# Altium project ECU.PrjPcb (part 1 of 2)
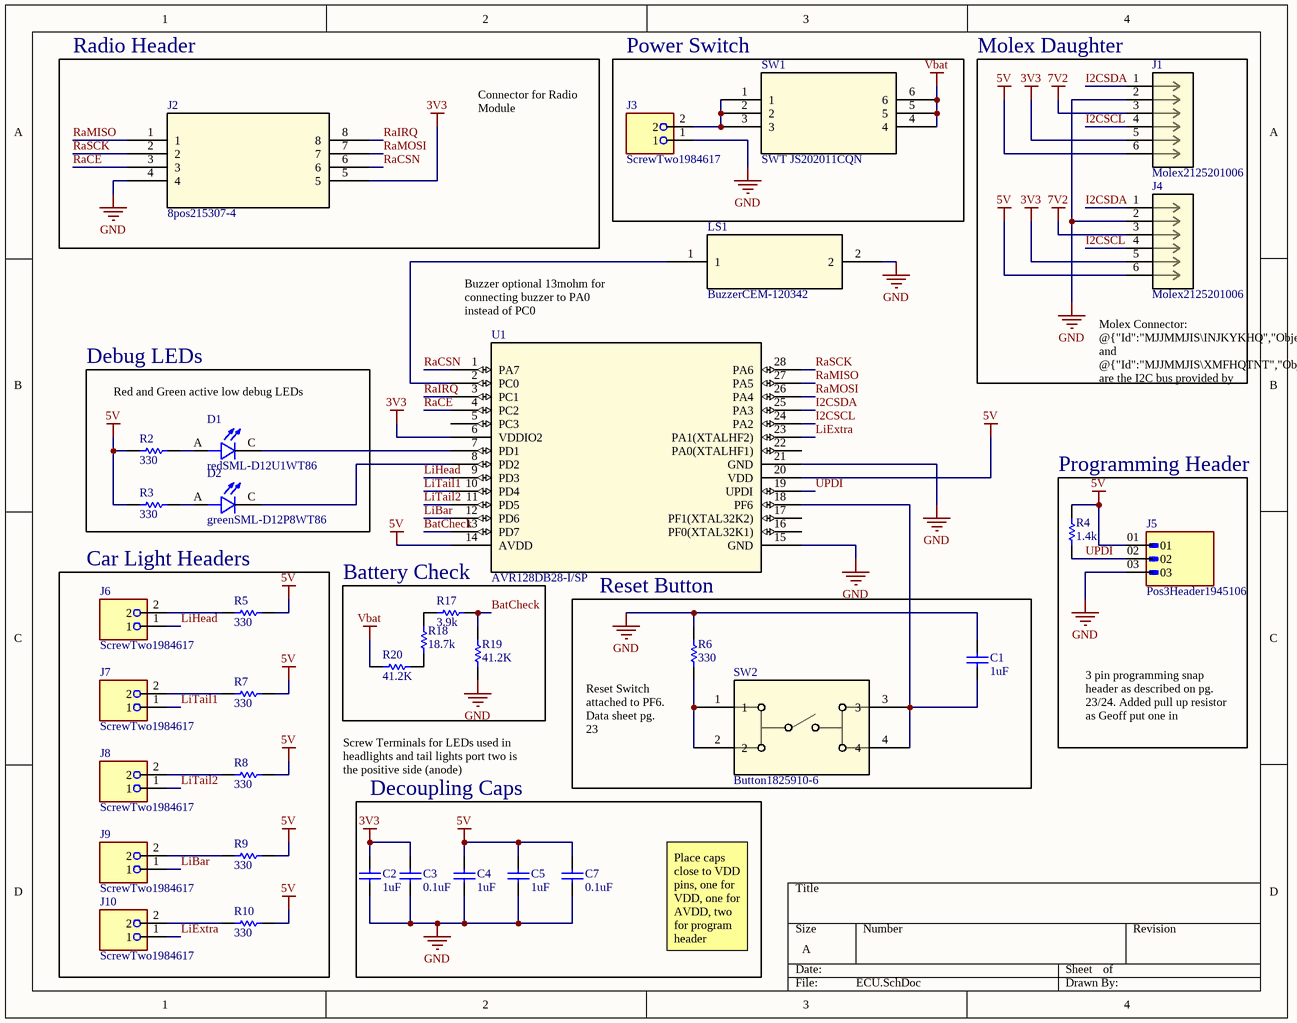
[diagram p0: ECU.SchDoc]
2 sheets, 63 parts. Net scope: global (net labels, ports and power ports of the same name join across sheets).
Board file: ecupcb.PcbDoc
Sheets:
  ECU.SchDoc
  PowerSupply.SchDoc

## Sheet ECU.SchDoc
size A; SheetNumber: 1; SheetTotal: 2

### Parts
C1  1uF  [RES 0805]
C2  1uF  [RES 0805]
C3  0.1uF  [RES 0805]
C4  1uF  [RES 0805]
C5  1uF  [RES 0805]
C7  0.1uF  [RES 0805]
D1  redSML-D12U1WT86  [0603LED]
D2  greenSML-D12P8WT86  [0603LED]
J1  Molex2125201006  [Molex2125201006]
J2  8pos215307-4  [215307-4]
J3  ScrewTwo1984617  [PHOENIX_1984617]
J4  Molex2125201006  [Molex2125201006]
J5  Pos3Header1945106  [Pos3Header]
J6  ScrewTwo1984617  [PHOENIX_1984617]
J7  ScrewTwo1984617  [PHOENIX_1984617]
J8  ScrewTwo1984617  [PHOENIX_1984617]
J9  ScrewTwo1984617  [PHOENIX_1984617]
J10  ScrewTwo1984617  [PHOENIX_1984617]
LS1  BuzzerCEM-120342  [CEM-1203(42)]
R2  330  [RES 0805]
R3  330  [RES 0805]
R4  1.4k  [RES 0805]
R5  330  [RES 0805]
R6  330  [RES 0805]
R7  330  [RES 0805]
R8  330  [RES 0805]
R9  330  [RES 0805]
R10  330  [RES 0805]
R17  3.9k  [RES 0805]
R18  18.7k  [RES 0805]
R19  41.2K  [RES 0805]
R20  41.2K  [RES 0805]
SW1  SWT JS202011CQN  [SWTJS202011CQN]
SW2  Button1825910-6  [Button1825910-6]
U1  AVR128DB28-I/SP  [AVR128DB28-ISP]

### Blocks framed on the sheet
Radio Header: J2
Power Switch: J3 SW1
Molex Daughter: J1 J4
Debug LEDs: D1 D2 R2 R3
Programming Header: J5 R4
Car Light Headers: J6-J10 R5 R7-R10
Battery Check: R17-R20
Reset Button: C1 R6 SW2
Decoupling Caps: C2-C5 C7

### Nets
3V3: C2.2 C3.2 J1.5 J2.5 J4.5 U1.6(VDDIO2)
5V: C4.2 C5.1 C7.2 J1.6 J4.6 J5.01 R2.1 R3.1 R4.2 R5.2 R7.2 R8.2 R9.2 R10.2 U1.14(AVDD) U1.20(VDD)
7V2: J1.3 J4.3
GND: C1.2 C2.1 C3.1 C4.1 C5.2 C7.1 J1.2 J2.4 J3.1 J4.2 J5.03 LS1.2 R6.2 R19.1 U1.15(GND) U1.21(GND)
Vbat: R20.2 SW1.4 SW1.5 SW1.6
BatCheck: R17.2 R19.2 U1.13(PD7)
I2CSCL: J1.4 J4.4 U1.24(PA2)
I2CSDA: J1.1 J4.1 U1.25(PA3)
LiBar: J9.1 U1.12(PD6)
LiExtra: J10.1 U1.23(PA1(XTALHF2))
LiHead: J6.1 U1.9(PD3)
LiTail1: J7.1 U1.10(PD4)
LiTail2: J8.1 U1.11(PD5)
RaCE: J2.3 U1.4(PC2)
RaCSN: J2.6 U1.1(PA7)
RaIRQ: J2.8 U1.3(PC1)
RaMISO: J2.1 U1.27(PA5)
RaMOSI: J2.7 U1.26(PA4)
RaSCK: J2.2 U1.28(PA6)
UPDI: J5.02 R4.1 U1.19(UPDI)
NetC1_1: C1.1 SW2.3 SW2.4 U1.18(PF6)
NetD1_A: D1.A R2.2
NetD1_C: D1.C U1.7(PD1)
NetD2_A: D2.A R3.2
NetD2_C: D2.C U1.8(PD2)
NetJ3_2: J3.2 SW1.1 SW1.2 SW1.3
NetJ6_2: J6.2 R5.1
NetJ7_2: J7.2 R7.1
NetJ8_2: J8.2 R8.1
NetJ9_2: J9.2 R9.1
NetJ10_2: J10.2 R10.1
NetLS1_1: LS1.1 U1.2(PC0)
NetR6_1: R6.1 SW2.1 SW2.2
NetR17_1: R17.1 R18.1
NetR18_2: R18.2 R20.1

Not connected (* = marked no-connect by the designer): U1 5(PC3) 16(PF0(XTAL32K1)) 17(PF1(XTAL32K2)) 22(PA0(XTALHF1))

### Notes on the sheet
- Connector for Radio Module
- (near U1) Buzzer optional 13mohm for connecting buzzer to PA0 instead of PC0
- Red and Green active low debug LEDs
- (near J4) Molex Connector: @{"Id":"MJJMMJIS\INJKYKHQ","ObjectType":1} and @{"Id":"MJJMMJIS\XMFHQTNT","ObjectType":1} are the I2C bus provided by the molex connector to slave boards
- Screw Terminals for LEDs used in headlights and tail lights port two is the positive side (anode)
- (near R6) Reset Switch attached to PF6. Data sheet pg. 23
- 3 pin programming snap header as described on pg. 23/24. Added pull up resistor as Geoff put one in
- Place caps close to VDD pins, one for VDD, one for AVDD, two for program header

### Library data of the parts
C1 C2 C4 C5 = CAP CER 1uF 10% 50V 0805: Ceramic Capacitor, Multilayer, Ceramic, 50V, 10% +Tol, 10% -Tol, X7R, 15% TC, 1uF, Surface Mount, 0805; Manufacturer: Samsung; Manufacturer Part Number: CL21B105KBFNNNE; Multilayer: Yes; Supplier: Digikey; Supplier Part Number: 1276-1029-1-ND; RoHS: Yes; Category: Ceramic Capacitors; Stock: 572828; Pricing: 1=0.1, 10=0.051, 100=0.0321, 1000=0.02181 (USD); Mounting Technology: Surface Mount; Pins: 2; Dielectric Material: Ceramic; Package Shape: Rectangular; Case/Package: 0805; Terminal Finish: Nickel; Min Operating Temperature: -55°C; Max Operating Temperature: 125°C; JESD-609 Code: e3; Value: 1uF; Capacitor Type: Ceramic; Tolerance  (fill in as +-): 10%; Package Style: SMTMeter; Packaging: Tape and Reel; Tolerance (fill in as +-): 10%; Rated DC Voltage (URdc): 50V; Temperature Characteristics Code: X7R; Termination: Wraparound; Length: 2mm; Width: 1.25mm; Height: 1.35mm; Reach SVHC Compliant: Yes; RoHS Compliant: Yes; ComponentLink1URL: https://datasheet.ciiva.com:443/pdfs/VipMasterIC/IC/SEMS/SEMS-S-A0008524728/SEMS-S-A0008523023-1.pdf?src-supplier=IHS+Markit; ComponentLink1Description: https://datasheet.ciiva.com:443/pdfs/VipMasterIC/IC/SEMS/SEMS-S-A0008524728/SEMS-S-A0008523023-1.pdf?src-supplier=IHS+Markit; ComponentLink2URL: https://datasheet.ciiva.com/25800/cl21b105kbfnnne-25800291.pdf?src-supplier=Digikey; ComponentLink2Description: https://datasheet.ciiva.com/25800/cl21b105kbfnnne-25800291.pdf?src-supplier=Digikey; ComponentLink3URL: https://datasheet.ciiva.com/16449/cl21b105kbfnnne-16449003.pdf?src-supplier=Future+Electronics; ComponentLink3Description: https://datasheet.ciiva.com/16449/cl21b105kbfnnne-16449003.pdf?src-supplier=Future+Electronics
C3 C7 = CAP CER 0.1uF 10% 50V 0805: Ceramic Capacitor, Multilayer, Ceramic, 50V, 10% +Tol, 10% -Tol, X7R, 15% TC, 0.1uF, Surface Mount, 0805; Manufacturer: Yageo; Manufacturer Part Number: CC0805KRX7R9BB104; Value: 100nF; Multilayer: Yes; Supplier: Digikey; Supplier Part Number: 311-1140-1-ND; RoHS: Yes; Category: Ceramic Capacitors; Stock: 3691132; Pricing: 1=0.08, 10=0.021, 100=0.0152, 1000=0.0144, 4000=0.0112, 8000=0.0104, 12000=0.01, 20000=0.00985 (USD); Mounting Technology: Surface Mount; Pins: 2; Dielectric Material: Ceramic; Package Shape: Rectangular; Case/Package: 0805; Terminal Finish: Nickel; Min Operating Temperature: -55°C; Max Operating Temperature: 125°C; JESD-609 Code: e3; Capacitor Type: Ceramic; Tolerance  (fill in as +-): 10%; Package Style: SMTMeter; Packaging: Tape and Reel; Tolerance (fill in as +-): 10%; Rated DC Voltage (URdc): 50V; Temperature Characteristics Code: X7R; Termination: Wraparound; Length: 2mm; Width: 1.25mm; Height: 0.85mm; Reach SVHC Compliant: Yes; RoHS Compliant: Yes; ComponentLink1URL: https://datasheet.ciiva.com:443/pdfs/VipMasterIC/IC/YAGO/YAGO-S-A0003557223/YAGO-S-A0003557223-1.pdf?src-supplier=IHS+Markit; ComponentLink1Description: https://datasheet.ciiva.com:443/pdfs/VipMasterIC/IC/YAGO/YAGO-S-A0003557223/YAGO-S-A0003557223-1.pdf?src-supplier=IHS+Markit; ComponentLink2URL: https://datasheet.ciiva.com/11786/0900766b80d84f1d-11786009.pdf?src-supplier=Rs; ComponentLink2Description: https://datasheet.ciiva.com/11786/0900766b80d84f1d-11786009.pdf?src-supplier=Rs; ComponentLink3URL: https://datasheet.ciiva.com/155/mlccorderingcode-155929.pdf?src-supplier=Digikey; ComponentLink3Description: https://datasheet.ciiva.com/155/mlccorderingcode-155929.pdf?src-supplier=Digikey; ComponentLink4URL: https://datasheet.ciiva.com/155/mlccorderingcode-155930.pdf?src-supplier=Digikey; ComponentLink4Description: https://datasheet.ciiva.com/155/mlccorderingcode-155930.pdf?src-supplier=Digikey; ComponentLink5URL: https://datasheet.ciiva.com/155/mlccorderingcode-155931.pdf?src-supplier=Digikey; ComponentLink5Description: https://datasheet.ciiva.com/155/mlccorderingcode-155931.pdf?src-supplier=Digikey; ComponentLink6URL: https://datasheet.ciiva.com/46393/1734573-46393307.pdf?src-supplier=Element14; ComponentLink6Description: https://datasheet.ciiva.com/46393/1734573-46393307.pdf?src-supplier=Element14; ComponentLink7URL: https://datasheet.ciiva.com/28450/1489800-28450805.pdf?src-supplier=Element14; ComponentLink7Description: https://datasheet.ciiva.com/28450/1489800-28450805.pdf?src-supplier=Element14; ComponentLink8URL: https://datasheet.ciiva.com/11464/upy-gphc-x7r-6-3v-to-50v-8-11464757.pdf?src-supplier=Avnet; ComponentLink8Description: https://datasheet.ciiva.com/11464/upy-gphc-x7r-6-3v-to-50v-8-11464757.pdf?src-supplier=Avnet; ComponentLink9URL: https://datasheet.ciiva.com/29242/445210-da-01-en-kerko-chip-0805-x7r-0-1uf-10proz-50vg-29242074.pdf?src-supplier=Conrad; ComponentLink9Description: https://datasheet.ciiva.com/29242/445210-da-01-en-kerko-chip-0805-x7r-0-1uf-10proz-50vg-29242074.pdf?src-supplier=Conrad
D1 = redSML-D12U1WT86: Single Color LED, Red, Milky White, 1.2mm; Manufacturer: Rohm; Shape: Rectangular; Forward Current: 20mA; Luminous Intensity-Nom: 63mcd; Channels: 1; Overall Height: 0.55mm; Supplier: Digikey; Supplier Part Number: SML-D12U1WT86CT-ND; Manufacturer Part Number: SML-D12U1WT86; RoHS: Yes; Category: LEDs; Stock: 145541; Pricing: 1=0.12, 10=0.081, 100=0.0556, 500=0.0438, 1000=0.03986 (USD); Mounting Technology: Surface Mount; Pins: 2; Color: Red; Min Operating Temperature: -40°C; Max Operating Temperature: 85°C; Lens Style: MILKY WHITE; Optoelectronic Device Type: SINGLE COLOR LED; Packaging: Tape and Reel; Size: 1.2mm; Terminal Pitch: 1.65mm; Reach SVHC Compliant: Yes; RoHS Compliant: Yes; ComponentLink1URL: https://datasheet.ciiva.com:443/pdfs/VipMasterIC/IC/ROHM/ROHM-S-A0002134492/ROHM-S-A0002134492-1.pdf?src-supplier=IHS+Markit; ComponentLink1Description: https://datasheet.ciiva.com:443/pdfs/VipMasterIC/IC/ROHM/ROHM-S-A0002134492/ROHM-S-A0002134492-1.pdf?src-supplier=IHS+Markit; ComponentLink2URL: https://www.rohm.com/datasheet/SML-D12U1W?src-supplier=Digikey; ComponentLink2Description: https://www.rohm.com/datasheet/SML-D12U1W?src-supplier=Digikey; ComponentLink3URL: https://datasheet.octopart.com/SML-D12U1WT86-Rohm-datasheet-68298509.pdf?src-supplier=Future+Electronics; ComponentLink3Description: https://datasheet.octopart.com/SML-D12U1WT86-Rohm-datasheet-68298509.pdf?src-supplier=Future+Electronics; ComponentLink4URL: https://datasheet.octopart.com/SML-D12U1WT86-ROHM-datasheet-142144710.pdf?src-supplier=TME; ComponentLink4Description: https://datasheet.octopart.com/SML-D12U1WT86-ROHM-datasheet-142144710.pdf?src-supplier=TME
D2 = greenSML-D12P8WT86: Single Color LED, Pure Green, Diffused Milky White, 1.2mm; Manufacturer: Rohm; Shape: Rectangular; Forward Current: 20mA; Luminous Intensity-Nom: 6.3mcd; Channels: 1; Reverse Voltage-Max: 5V; Overall Height: 0.55mm; Supplier: Digikey; Supplier Part Number: 846-SML-D12P8WT86CT-ND; Manufacturer Part Number: SML-D12P8WT86; RoHS: Yes; Category: LEDs; Stock: 24850; Pricing: 1=0.14, 10=0.094, 100=0.0648, 500=0.05124, 1000=0.04672 (USD); Mounting Technology: Surface Mount; Pins: 2; Color: Green; Color@wavelength: Green; Terminal Finish: Gold; Min Operating Temperature: -40°C; Max Operating Temperature: 85°C; JESD-609 Code: e4; Lens Style: Diffused; Optoelectronic Device Type: SINGLE COLOR LED; Packaging: Tape and Reel; Size: 1.2mm; Terminal Pitch: 1.65mm; Reach SVHC Compliant: Yes; RoHS Compliant: Yes; ComponentLink1URL: https://datasheet.ciiva.com:443/pdfs/VipMasterIC/IC/ROHM/ROHMS10041/ROHMS10041-1.pdf?src-supplier=IHS+Markit; ComponentLink1Description: https://datasheet.ciiva.com:443/pdfs/VipMasterIC/IC/ROHM/ROHMS10041/ROHMS10041-1.pdf?src-supplier=IHS+Markit; ComponentLink2URL: https://datasheet.ciiva.com/2110/sml-d1-2110417.pdf?src-supplier=Digikey; ComponentLink2Description: https://datasheet.ciiva.com/2110/sml-d1-2110417.pdf?src-supplier=Digikey; ComponentLink3URL: https://datasheet.ciiva.com/16488/rohm20sml-d12p8wt86-16488100.pdf?src-supplier=Future+Electronics; ComponentLink3Description: https://datasheet.ciiva.com/16488/rohm20sml-d12p8wt86-16488100.pdf?src-supplier=Future+Electronics; ComponentLink4URL: https://datasheet.ciiva.com/2110/sml-d1-2110418.pdf?src-supplier=Digikey; ComponentLink4Description: https://datasheet.ciiva.com/2110/sml-d1-2110418.pdf?src-supplier=Digikey; ComponentLink5URL: https://datasheet.ciiva.com/2110/sml-d1-2110419.pdf?src-supplier=Digikey; ComponentLink5Description: https://datasheet.ciiva.com/2110/sml-d1-2110419.pdf?src-supplier=Digikey; ComponentLink6URL: https://datasheet.ciiva.com/3161/sml-d1-3161420.pdf?src-supplier=Avnet; ComponentLink6Description: https://datasheet.ciiva.com/3161/sml-d1-3161420.pdf?src-supplier=Avnet
J1 J4 = Molex2125201006: Connector Power Header 6 Position 4.2mm Solder Through Hole Tray; Manufacturer: Molex; Manufacturer Part Number: 212520-1006; Supplier: Arrow Electronics; Supplier Part Number: 212520-1006; RoHS: No; Category: Connectors; Stock: 2143; Pricing: 1=1.083 (USD)
J2 = 8pos215307-4: Board Connector, 4 Contact(s), 2 Row(s), Female, Straight, 0.1 inch Pitch, Solder Terminal, Black Insulator, Receptacle; Manufacturer: TE Connectivity; Option: General Purpose; Contact Pattern: RECTANGULAR; Contact Style: BELLOWED TYPE; Dielectric Withstanding Voltage (AC): 750V; Filter Feature: No; Insulation Resistance: 5GR; Number Of Connectors: 1; Number Of PCB Rows: 2; Number of Contacts: 8; Body Breadth: 0.199inch; Body Depth: 0.276inch; PCB Contact Row Spacing: 2.54mm; Plating Thickness: 31uin; Reference Standard: UL; Reliability: COMMERCIAL; Supplier: Avnet; Supplier Part Number: 98K6517; Manufacturer Part Number: 215307-4; RoHS: Yes; Category: Headers and Wire Housings; Stock: 250; Pricing: 1=0.863, 10=0.776, 25=0.761, 50=0.746, 100=0.731 (USD); Mounting Technology: Board; Contact Material: Bronze; Contact Finish - Mating: NOT SPECIFIED; Contact Finish - Termination: Tin (Sn); Insulation Color: Green; Insulation Material: Glass; Min Operating Temperature: -65°C; Max Operating Temperature: 125°C; JESD-609 Code: e3; Connector Type: BOARD CONNECTOR; Body/Shell Style: RECEPTACLE; Contact Gender: Female; Mixed Contacts: No; Mounting Style: STRAIGHT; Number of Rows Loaded: 2; PCB Contact Pattern: RECTANGULAR; Termination: Solder; Mating Contact Pitch: 0.1inch; Mating Contact Row Spacing: 0.1inch; Terminal Length: 0.118inch; Terminal Pitch: 2.54mm; Flammability Rating: UL94 V-0; Reach SVHC Compliant: Yes; RoHS Compliant: Yes; DIN Conformance: No; IEC Conformance: No; MIL Conformance: No; ComponentLink1URL: https://www.te.com:443/usa-en/product-215307-4.html?src-supplier=IHS+Markit; ComponentLink1Description: https://www.te.com:443/usa-en/product-215307-4.html?src-supplier=IHS+Markit; ComponentLink2URL: https://datasheet.ciiva.com/30070/2153074-30070134.pdf?src-supplier=Onlinecomponents.com; ComponentLink2Description: https://datasheet.ciiva.com/30070/2153074-30070134.pdf?src-supplier=Onlinecomponents.com; ComponentLink3URL: https://datasheet.ciiva.com/11748/0900766b804f4b20-11748752.pdf?src-supplier=Rs; ComponentLink3Description: https://datasheet.ciiva.com/11748/0900766b804f4b20-11748752.pdf?src-supplier=Rs; ComponentLink4URL: https://datasheet.ciiva.com/29369/001094904-da-01-en-buchsenleiste-2-reihig-0-0215307-4-29369976.pdf?src-supplier=Conrad; ComponentLink4Description: https://datasheet.ciiva.com/29369/001094904-da-01-en-buchsenleiste-2-reihig-0-0215307-4-29369976.pdf?src-supplier=Conrad; ComponentLink5URL: https://datasheet.ciiva.com/6857/eng-cd-215307-d-basefilename-6857485.pdf?src-supplier=Digikey; ComponentLink5Description: https://datasheet.ciiva.com/6857/eng-cd-215307-d-basefilename-6857485.pdf?src-supplier=Digikey
J3 J6-J10 = ScrewTwo1984617: Barrier Strip Terminal Block, 17.5A, 1.5mm2, 1 Row(s), 1 Deck(s); Manufacturer: Phoenix Contact; Voltage Rating: 200V; Fastening Method: SCREW; Number of Decks: 1; Number of Ways: 2; Wire/Cable Gauge: 16AWG; Safety Approval: UL,CUL,EAC; Supplier: Digikey; Supplier Part Number: 277-1721-ND; Manufacturer Part Number: 1984617; RoHS: Yes; Category: Terminal Blocks; Stock: 1429; Pricing: 1=0.62, 10=0.598, 50=0.572, 100=0.5564, 250=0.52, 500=0.4784, 1000=0.442, 2500=0.4225 (USD); Mounting Technology: Board; Current Rating: 17.5A; Manufacturer Series: 1984617; Number of Rows: 1; Terminal and Terminal Block Type: BARRIER STRIP TERMINAL BLOCK; Wire Cross Section: 1.5mm2; RoHS Compliant: Yes; Reach SVHC Compliant: No; ComponentLink1URL: https://datasheet.ciiva.com:443/pdfs/VipMasterIC/IC/PCON/PCON-S-A0001273034/PCON-S-A0001273034-1.pdf?src-supplier=IHS+Markit; ComponentLink1Description: https://datasheet.ciiva.com:443/pdfs/VipMasterIC/IC/PCON/PCON-S-A0001273034/PCON-S-A0001273034-1.pdf?src-supplier=IHS+Markit; ComponentLink2URL: https://datasheet.ciiva.com/15169/getdatasheetpartid-212214-15169950.pdf?src-supplier=Verical; ComponentLink2Description: https://datasheet.ciiva.com/15169/getdatasheetpartid-212214-15169950.pdf?src-supplier=Verical; ComponentLink3URL: https://datasheet.ciiva.com/11758/0900766b811d7588-11758486.pdf?src-supplier=Rs; ComponentLink3Description: https://datasheet.ciiva.com/11758/0900766b811d7588-11758486.pdf?src-supplier=Rs; ComponentLink4URL: https://datasheet.ciiva.com/16070/1984617-16070639.pdf?src-supplier=Onlinecomponents.com; ComponentLink4Description: https://datasheet.ciiva.com/16070/1984617-16070639.pdf?src-supplier=Onlinecomponents.com; ComponentLink5URL: https://datasheet.ciiva.com/3969/1984617-3969923.pdf?src-supplier=Arrow+Electronics; ComponentLink5Description: https://datasheet.ciiva.com/3969/1984617-3969923.pdf?src-supplier=Arrow+Electronics; ComponentLink6URL: https://datasheet.ciiva.com/823/combiconcompactseries-823754.pdf?src-supplier=Digikey; ComponentLink6Description: https://datasheet.ciiva.com/823/combiconcompactseries-823754.pdf?src-supplier=Digikey
J5 = Pos3Header1945106: Board Connector, 3 Contact(s), 1 Row(s), Male, Straight, Solder Terminal, Black Insulator; Manufacturer: Phoenix Contact; Manufacturer Part Number: PST1,0/3-3,5; Supplier: Digikey; Supplier Part Number: 277-1750-ND; RoHS: Yes; Stock: 12044; Pricing: 1=0.24, 10=0.237 (USD); Connector Type: BOARD CONNECTOR; Reach SVHC Compliant: Yes; RoHS Compliant: Yes; ComponentLink1URL: https://datasheet.ciiva.com:443/pdfs/VipMasterIC/IC/PCON/PCON-S-A0009615332/PCON-S-A0009615332-1.pdf?src-supplier=IHS+Markit; ComponentLink1Description: https://datasheet.ciiva.com:443/pdfs/VipMasterIC/IC/PCON/PCON-S-A0009615332/PCON-S-A0009615332-1.pdf?src-supplier=IHS+Markit; ComponentLink2URL: https://datasheet.octopart.com/1945106-Phoenix-Contact-datasheet-66579486.pdf?src-supplier=Element14; ComponentLink2Description: https://datasheet.octopart.com/1945106-Phoenix-Contact-datasheet-66579486.pdf?src-supplier=Element14; ComponentLink3URL: https://datasheet.octopart.com/1945106-Phoenix-Contact-datasheet-38259.pdf?src-supplier=Digikey; ComponentLink3Description: https://datasheet.octopart.com/1945106-Phoenix-Contact-datasheet-38259.pdf?src-supplier=Digikey
LS1 = BuzzerCEM-120342: Audio Signaling/Alarm Devices; Manufacturer: CUI Devices; Supplier: Arrow Electronics; Supplier Part Number: CEM-1203(42); Manufacturer Part Number: CEM-1203(42); RoHS: Yes; Category: Buzzers; Stock: 12257; Pricing: 1=0.5383, 10=0.4658, 25=0.4267, 40=0.4109, 80=0.3857, 230=0.3659, 500=0.365 (USD); ComponentLink1URL: https://www.cuidevices.com/product/resource/digikeypdf/cem-1203-42-.pdf?src-supplier=Digikey; ComponentLink1Description: https://www.cuidevices.com/product/resource/digikeypdf/cem-1203-42-.pdf?src-supplier=Digikey; ComponentLink2URL: https://datasheet.octopart.com/CEM-1203%2842%29-CUI-Devices-datasheet-175926661.pdf?src-supplier=Future+Electronics; ComponentLink2Description: https://datasheet.octopart.com/CEM-1203%2842%29-CUI-Devices-datasheet-175926661.pdf?src-supplier=Future+Electronics; ComponentLink3URL: https://datasheet.octopart.com/CEM-1203%2842%29-Same-Sky-datasheet-182879445.pdf?src-supplier=Electro+Sonic; ComponentLink3Description: https://datasheet.octopart.com/CEM-1203%2842%29-Same-Sky-datasheet-182879445.pdf?src-supplier=Electro+Sonic; ComponentLink4URL: https://datasheet.octopart.com/CEM-1203%2842%29-CUI-Devices-datasheet-175925305.pdf?src-supplier=Master+Electronics; ComponentLink4Description: https://datasheet.octopart.com/CEM-1203%2842%29-CUI-Devices-datasheet-175925305.pdf?src-supplier=Master+Electronics
R2 R3 R5-R10 = RES 330 1% 0.125W 0805: Fixed Resistor, Metal Glaze/thick Film, 0.125W, 330ohm, 150V, 1% +/-Tol, 100ppm/Cel, Surface Mount, 0805; Manufacturer: Stackpole Electronics; Manufacturer Part Number: RMCF0805FT330R; Power: 125mW; Rated Temperature: 70°C; Value: 330R; Temperature Coefficient (ppm/Cel): 100; Package Height: 0.5mm; Package Length: 2mm; Package Width: 1.25mm; Reference Standard: AEC-Q200; Supplier: Digikey; Supplier Part Number: RMCF0805FT330RCT-ND; RoHS: Yes; Category: Chip SMD Resistors; Stock: 270482; Pricing: 1=0.1, 10=0.025, 100=0.012, 1000=0.00658, 2500=0.00564 (USD); Mounting Technology: Surface Mount; Pins: 2; Package Shape: Rectangular; Case/Package: 0805; Terminal Finish: Nickel; Min Operating Temperature: -55°C; Max Operating Temperature: 155°C; Tolerance: 1%; JESD-609 Code: e3; Resistor Type: FIXED RESISTOR; Construction: Rectangular; Packaging: Tape and Reel; Technology: METAL GLAZE/THICK FILM; Termination: Wraparound; Working Voltage: 150V; Reach SVHC Compliant: Yes; RoHS Compliant: Yes; ComponentLink1URL: https://datasheet.ciiva.com:443/pdfs/VipMasterIC/IC/SEIE/SEIE-S-A0009541969/SEIE-S-A0009541969-1.pdf?src-supplier=IHS+Markit; ComponentLink1Description: https://datasheet.ciiva.com:443/pdfs/VipMasterIC/IC/SEIE/SEIE-S-A0009541969/SEIE-S-A0009541969-1.pdf?src-supplier=IHS+Markit; ComponentLink2URL: http://components.arrow.com/part/dataview/40963487S9848862N1174?src-supplier=Arrow+Electronics; ComponentLink2Description: http://components.arrow.com/part/dataview/40963487S9848862N1174?src-supplier=Arrow+Electronics; ComponentLink3URL: https://www.seielect.com/catalog/SEI-RMCF_RMCP.pdf?src-supplier=Avnet; ComponentLink3Description: https://www.seielect.com/catalog/SEI-RMCF_RMCP.pdf?src-supplier=Avnet; ComponentLink4URL: https://www.seielect.com/catalog/sei-rmcf_rmcp.pdf?src-supplier=Digikey; ComponentLink4Description: https://www.seielect.com/catalog/sei-rmcf_rmcp.pdf?src-supplier=Digikey; ComponentLink5URL: https://www.seielect.com/catalog/SEI-Packaging.pdf?src-supplier=Digikey; ComponentLink5Description: https://www.seielect.com/catalog/SEI-Packaging.pdf?src-supplier=Digikey; ComponentLink6URL: https://www.verical.com/server-webapp/html/getDatasheet?partID=559884&src-supplier=Verical; ComponentLink6Description: https://www.verical.com/server-webapp/html/getDatasheet?partID=559884&src-supplier=Verical; ComponentLink7URL: https://datasheet.octopart.com/RMCF0805FT330R-Stackpole-Electronics-datasheet-12534581.pdf?src-supplier=Future+Electronics; ComponentLink7Description: https://datasheet.octopart.com/RMCF0805FT330R-Stackpole-Electronics-datasheet-12534581.pdf?src-supplier=Future+Electronics
R4 = RES 1.4k 1% 0.125W 0805: Fixed Resistor, Metal Glaze/thick Film, 0.125W, 1400ohm, 150V, 1% +/-Tol, 100ppm/Cel, Surface Mount, 0805; Manufacturer: Yageo; Manufacturer Part Number: RC0805FR-071K4L; Additional Feature: LASER TRIMMABLE; Power: 125mW; Rated Temperature: 70°C; Value: 1.4kR; Temperature Coefficient (ppm/Cel): 100; Package Height: 0.5mm; Package Length: 2mm; Package Width: 1.25mm; Supplier: Future Electronics; Supplier Part Number: 5205166; RoHS: Yes; Category: Chip SMD Resistors; Stock: 70000; Pricing: 5000=0.0021, 20000=0.002, 100000=0.0019, 200000=0.0018, 625000=0.0017 (USD); Mounting Technology: Surface Mount; Pins: 2; Package Shape: Rectangular; Case/Package: 0805; Terminal Finish: Nickel; Min Operating Temperature: -55°C; Max Operating Temperature: 155°C; Tolerance: 1%; JESD-609 Code: e3; Resistor Type: FIXED RESISTOR; Construction: Chip; Packaging: Tape and Reel; Technology: METAL GLAZE/THICK FILM; Termination: Wraparound; Working Voltage: 150V; Reach SVHC Compliant: Yes; RoHS Compliant: Yes; ComponentLink1URL: https://datasheet.ciiva.com:443/pdfs/VipMasterIC/IC/YAGO/YAGO-S-A0008145938/YAGO-S-A0008145938-1.pdf?src-supplier=IHS+Markit; ComponentLink1Description: https://datasheet.ciiva.com:443/pdfs/VipMasterIC/IC/YAGO/YAGO-S-A0008145938/YAGO-S-A0008145938-1.pdf?src-supplier=IHS+Markit; ComponentLink2URL: https://datasheet.ciiva.com/2519/pyu-r-int-thick-7-2519780.pdf?src-supplier=Digikey; ComponentLink2Description: https://datasheet.ciiva.com/2519/pyu-r-int-thick-7-2519780.pdf?src-supplier=Digikey; ComponentLink3URL: https://datasheet.ciiva.com/2519/pyu-r-int-thick-7-2519781.pdf?src-supplier=Digikey; ComponentLink3Description: https://datasheet.ciiva.com/2519/pyu-r-int-thick-7-2519781.pdf?src-supplier=Digikey; ComponentLink4URL: https://datasheet.ciiva.com/2519/pyu-r-int-thick-7-2519782.pdf?src-supplier=Digikey; ComponentLink4Description: https://datasheet.ciiva.com/2519/pyu-r-int-thick-7-2519782.pdf?src-supplier=Digikey; ComponentLink5URL: https://datasheet.ciiva.com/5596/rc0805-5596057.pdf?src-supplier=Mouser; ComponentLink5Description: https://datasheet.ciiva.com/5596/rc0805-5596057.pdf?src-supplier=Mouser; ComponentLink6URL: https://datasheet.ciiva.com/17033/rc0805-17033654.pdf?src-supplier=Future+Electronics; ComponentLink6Description: https://datasheet.ciiva.com/17033/rc0805-17033654.pdf?src-supplier=Future+Electronics
R17 = RES 3.9k 1% 0.125W 0805: Fixed Resistor, Metal Glaze/thick Film, 0.125W, 3920ohm, 150V, 1% +/-Tol, 100ppm/Cel, Surface Mount, 0805; Manufacturer: Stackpole Electronics; Manufacturer Part Number: RMCF0805FT3K92; Power: 125mW; Rated Temperature: 70°C; Value: 3.92kR; Temperature Coefficient (ppm/Cel): 100; Package Height: 0.5mm; Package Length: 2mm; Package Width: 1.25mm; Reference Standard: AEC-Q200; Supplier: Digikey; Supplier Part Number: RMCF0805FT3K92CT-ND; RoHS: Yes; Category: Chip SMD Resistors; Stock: 141516; Pricing: 1=0.1, 10=0.021, 50=0.0128, 100=0.0105, 500=0.00704, 1000=0.00602 (USD); Mounting Technology: Surface Mount; Pins: 2; Package Shape: Rectangular; Case/Package: 0805; Terminal Finish: Nickel; Min Operating Temperature: -55°C; Max Operating Temperature: 155°C; Tolerance: 1%; JESD-609 Code: e3; Resistor Type: FIXED RESISTOR; Construction: Rectangular; Packaging: Tape and Reel; Technology: METAL GLAZE/THICK FILM; Termination: Wraparound; Working Voltage: 150V; Reach SVHC Compliant: Yes; RoHS Compliant: Yes; ComponentLink1URL: https://datasheet.ciiva.com:443/pdfs/VipMasterIC/IC/SEIE/SEIE-S-A0009541969/SEIE-S-A0009541969-1.pdf?src-supplier=IHS+Markit; ComponentLink1Description: https://datasheet.ciiva.com:443/pdfs/VipMasterIC/IC/SEIE/SEIE-S-A0009541969/SEIE-S-A0009541969-1.pdf?src-supplier=IHS+Markit; ComponentLink2URL: https://datasheet.ciiva.com/3882/40960751s7172021n1174-3882844.pdf?src-supplier=Arrow+Electronics; ComponentLink2Description: https://datasheet.ciiva.com/3882/40960751s7172021n1174-3882844.pdf?src-supplier=Arrow+Electronics; ComponentLink3URL: https://datasheet.ciiva.com/15193/getdatasheetpartid-565526-15193591.pdf?src-supplier=Verical; ComponentLink3Description: https://datasheet.ciiva.com/15193/getdatasheetpartid-565526-15193591.pdf?src-supplier=Verical
R18 = RES 18.7k 1% 0.125W 0805: Fixed Resistor, Metal Glaze/thick Film, 0.125W, 18700ohm, 150V, 1% +/-Tol, 100ppm/Cel, Surface Mount, 0805; Manufacturer: Stackpole Electronics; Manufacturer Part Number: RMCF0805FT18K7; Power: 125mW; Rated Temperature: 70°C; Value: 18.7kR; Temperature Coefficient (ppm/Cel): 100; Package Height: 0.5mm; Package Length: 2mm; Package Width: 1.25mm; Reference Standard: AEC-Q200; Supplier: Digikey; Supplier Part Number: RMCF0805FT18K7CT-ND; RoHS: Yes; Category: Chip SMD Resistors; Stock: 214137; Pricing: 1=0.1, 10=0.025, 100=0.012, 1000=0.00628, 2500=0.00538 (USD); Mounting Technology: Surface Mount; Pins: 2; Package Shape: Rectangular; Case/Package: 0805; Terminal Finish: Nickel; Min Operating Temperature: -55°C; Max Operating Temperature: 155°C; Tolerance: 1%; JESD-609 Code: e3; Resistor Type: FIXED RESISTOR; Construction: Rectangular; Packaging: Tape and Reel; Technology: METAL GLAZE/THICK FILM; Termination: Wraparound; Working Voltage: 150V; Reach SVHC Compliant: Yes; RoHS Compliant: Yes; ComponentLink1URL: https://datasheet.ciiva.com:443/pdfs/VipMasterIC/IC/SEIE/SEIE-S-A0009541969/SEIE-S-A0009541969-1.pdf?src-supplier=IHS+Markit; ComponentLink1Description: https://datasheet.ciiva.com:443/pdfs/VipMasterIC/IC/SEIE/SEIE-S-A0009541969/SEIE-S-A0009541969-1.pdf?src-supplier=IHS+Markit; ComponentLink2URL: http://components.arrow.com/part/dataview/50586056S357577N1174?src-supplier=Arrow+Electronics; ComponentLink2Description: http://components.arrow.com/part/dataview/50586056S357577N1174?src-supplier=Arrow+Electronics; ComponentLink3URL: https://www.seielect.com/catalog/sei-rmcf_rmcp.pdf?src-supplier=Digikey; ComponentLink3Description: https://www.seielect.com/catalog/sei-rmcf_rmcp.pdf?src-supplier=Digikey; ComponentLink4URL: https://www.seielect.com/catalog/SEI-RMCF_RMCP.pdf?src-supplier=Avnet; ComponentLink4Description: https://www.seielect.com/catalog/SEI-RMCF_RMCP.pdf?src-supplier=Avnet; ComponentLink5URL: https://datasheet.octopart.com/RMCF0805FT18K7-Stackpole-Electronics-datasheet-28504820.pdf?src-supplier=Future+Electronics; ComponentLink5Description: https://datasheet.octopart.com/RMCF0805FT18K7-Stackpole-Electronics-datasheet-28504820.pdf?src-supplier=Future+Electronics
R19 R20 = RES 41.2K 1% 0.125W 0805: Fixed Resistor, Metal Glaze/thick Film, 0.125W, 41200ohm, 150V, 1% +/-Tol, 100ppm/Cel, Surface Mount, 0805; Manufacturer: Vishay; Manufacturer Part Number: CRCW080541K2FKEA; Power: 125mW; Value: 41.2kR; Temperature Coefficient (ppm/Cel): 100; Rated Temperature: 70°C; Package Height: 0.45mm; Package Length: 2mm; Package Width: 1.25mm; Reference Standard: AEC-Q200; Supplier: Arrow Electronics; Supplier Part Number: CRCW080541K2FKEA; RoHS: Yes; Category: Chip SMD Resistors; Stock: 1; Pricing: 1=0.0041 (USD); Mounting Technology: Surface Mount; Pins: 2; Case/Package: 0805; Terminal Finish: Nickel; Package Shape: Rectangular; Min Operating Temperature: -55°C; Max Operating Temperature: 155°C; Tolerance: 1%; JESD-609 Code: e3; Resistor Type: FIXED RESISTOR; Construction: Chip; Packaging: Tape and Reel; Technology: METAL GLAZE/THICK FILM; Working Voltage: 150V; Termination: Wraparound; Reach SVHC Compliant: Yes; RoHS Compliant: Yes; ComponentLink1URL: https://datasheet.ciiva.com:443/pdfs/VipMasterIC/IC/VISH/VISH-S-A0007266705/VISH-S-A0007266705-1.pdf?src-supplier=IHS+Markit; ComponentLink1Description: https://datasheet.ciiva.com:443/pdfs/VipMasterIC/IC/VISH/VISH-S-A0007266705/VISH-S-A0007266705-1.pdf?src-supplier=IHS+Markit; ComponentLink2URL: https://datasheet.ciiva.com/2467/dcrcwe3-2467875.pdf?src-supplier=Digikey; ComponentLink2Description: https://datasheet.ciiva.com/2467/dcrcwe3-2467875.pdf?src-supplier=Digikey; ComponentLink3URL: https://datasheet.ciiva.com/2467/dcrcwe3-2467876.pdf?src-supplier=Digikey; ComponentLink3Description: https://datasheet.ciiva.com/2467/dcrcwe3-2467876.pdf?src-supplier=Digikey; ComponentLink4URL: https://datasheet.ciiva.com/2467/dcrcwe3-2467877.pdf?src-supplier=Digikey; ComponentLink4Description: https://datasheet.ciiva.com/2467/dcrcwe3-2467877.pdf?src-supplier=Digikey; ComponentLink5URL: https://datasheet.ciiva.com/9009/dcrcwe3-9009672.pdf?src-supplier=Avnet; ComponentLink5Description: https://datasheet.ciiva.com/9009/dcrcwe3-9009672.pdf?src-supplier=Avnet; ComponentLink6URL: https://datasheet.ciiva.com/5552/dcrcwe3-109170-5552669.pdf?src-supplier=Mouser; ComponentLink6Description: https://datasheet.ciiva.com/5552/dcrcwe3-109170-5552669.pdf?src-supplier=Mouser; ComponentLink7URL: https://datasheet.ciiva.com/7671/1697337-7671701.pdf?src-supplier=Element14; ComponentLink7Description: https://datasheet.ciiva.com/7671/1697337-7671701.pdf?src-supplier=Element14; ComponentLink8URL: https://datasheet.ciiva.com/7725/125364-7725967.pdf?src-supplier=Element14; ComponentLink8Description: https://datasheet.ciiva.com/7725/125364-7725967.pdf?src-supplier=Element14; ComponentLink9URL: https://datasheet.ciiva.com/22702/1697337-22702910.pdf?src-supplier=Element14; ComponentLink9Description: https://datasheet.ciiva.com/22702/1697337-22702910.pdf?src-supplier=Element14; ComponentLink10URL: https://datasheet.ciiva.com/16200/dcrcwe3-16200485.pdf?src-supplier=Future+Electronics; ComponentLink10Description: https://datasheet.ciiva.com/16200/dcrcwe3-16200485.pdf?src-supplier=Future+Electronics
SW1 = SWT JS202011CQN: Slide Switch, 1 Positions, DPDT, Latched, 0.3A, 6VDC, 6 PCB Hole Cnt, Solder Terminal, Through Hole-straight; Manufacturer: ITT C&K; Manufacturer Series: JS; Actuator Material: Nylon; End Contact Plating: Silver; Actuator Color: Black; End Contact Material: Copper Alloy; Additional Feature: Low Profile; Contact Current(DC)-Max: 300mA; Contact DC Max Rating R Load: .3A@6VDC; Contact Resistance: 0.07mR; Contact Voltage(DC)-Max: 6V; Dielectric Withstand Volts: 500VACV; Insulation Resistance: 100MR; Number of Positions: 1; PCB Hole Count: 6; Actuator Length: 0.079inch; Body Breadth: 3.6mm; Body Height: 3.5mm; Body Length or Diameter: 9mm; Supplier: Digikey; Supplier Part Number: 401-2001-ND; Manufacturer Part Number: JS202011CQN; RoHS: Yes; Category: Slide Switches; Stock: 6723; Pricing: 1=0.71, 10=0.624, 25=0.5904, 100=0.5424, 250=0.51252, 500=0.49084, 1000=0.46997, 3000=0.43849, 5000=0.42451 (USD); Mounting Technology: Through Hole; Contact Material: Copper Alloy; Center Contact Plating: Silver; Housing Material: Nylon; Terminal Finish: Silver; Terminal Material: Brass; Min Operating Temperature: -40°C; Max Operating Temperature: 85°C; JESD-609 Code: e4; Actuator Type: SLIDE; Switch Action: LATCHED; Switch Function: DPDT; Switch Type: Slide Switch; Termination: Solder; Terminal Length: 0.118inch; Reach SVHC Compliant: Yes; RoHS Compliant: Yes; ComponentLink1URL: https://datasheet.ciiva.com:443/pdfs/VipMasterIC/IC/CKCI/CKCI-S-A0001404160/CKCI-S-A0002247603-1.pdf?src-supplier=IHS+Markit; ComponentLink1Description: https://datasheet.ciiva.com:443/pdfs/VipMasterIC/IC/CKCI/CKCI-S-A0001404160/CKCI-S-A0002247603-1.pdf?src-supplier=IHS+Markit; ComponentLink2URL: https://datasheet.ciiva.com/8082/js-9dec14-8082522.pdf?src-supplier=Avnet; ComponentLink2Description: https://datasheet.ciiva.com/8082/js-9dec14-8082522.pdf?src-supplier=Avnet; ComponentLink3URL: https://datasheet.ciiva.com/2889/js-9dec14-2889166.pdf?src-supplier=Digikey; ComponentLink3Description: https://datasheet.ciiva.com/2889/js-9dec14-2889166.pdf?src-supplier=Digikey; ComponentLink4URL: https://datasheet.ciiva.com/5280/js-15sept15-5280375.pdf?src-supplier=Mouser; ComponentLink4Description: https://datasheet.ciiva.com/5280/js-15sept15-5280375.pdf?src-supplier=Mouser; ComponentLink5URL: https://datasheet.ciiva.com/22630/1707718-22630695.pdf?src-supplier=Element14; ComponentLink5Description: https://datasheet.ciiva.com/22630/1707718-22630695.pdf?src-supplier=Element14
SW2 = Button1825910-6: Keypad Switch, 1 Switches, SPST, Momentary-tactile, 0.05A, 24VDC, 2.06N, 4 PCB Hole Cnt, Solder Terminal, Through Hole-straight; Manufacturer: TE Connectivity Alcoswitch; Circuit Configuration: 1X1; Contact Current(DC)-Max: 50mA; Contact DC Max Rating R Load: .05A@24VDC; Contact Voltage(DC)-Max: 24V; Number of Switches: 1; Body Breadth: 5.99mm; Body Height: 3.61mm; Supplier: Avnet; Supplier Part Number: 1825910-6; Manufacturer Part Number: 1825910-6; RoHS: Yes; Category: Pushbutton Switches; Stock: 150345; Pricing: 1=0.04963, 10=0.04908, 30=0.04866, 50=0.04823, 100=0.0478 (USD); Mounting Technology: Through Hole; Min Operating Temperature: -35°C; Max Operating Temperature: 85°C; Termination: Solder; Operating Force-Max: 2.06N; Switch Action: MOMENTARY; Switch Function: SPST; Switch Type: Keypad; Body Length or Diameter: 5.99mm; Reach SVHC Compliant: Yes; RoHS Compliant: Yes; ComponentLink1URL: https://datasheet.ciiva.com:443/pdfs/VipMasterIC/IC/TYEL/TYEL-S-A0008869674/TYEL-S-A0008850909-1.pdf?src-supplier=IHS+Markit; ComponentLink1Description: https://datasheet.ciiva.com:443/pdfs/VipMasterIC/IC/TYEL/TYEL-S-A0008869674/TYEL-S-A0008850909-1.pdf?src-supplier=IHS+Markit; ComponentLink2URL: https://datasheet.ciiva.com/30199/1825910-6rqpn1825910-6-30199520.pdf?src-supplier=Onlinecomponents.com; ComponentLink2Description: https://datasheet.ciiva.com/30199/1825910-6rqpn1825910-6-30199520.pdf?src-supplier=Onlinecomponents.com; ComponentLink3URL: https://datasheet.ciiva.com/15184/getdatasheetpartid-395915-15184509.pdf?src-supplier=Verical; ComponentLink3Description: https://datasheet.ciiva.com/15184/getdatasheetpartid-395915-15184509.pdf?src-supplier=Verical
U1 = AVR128DB28-I/SP: RISC Microcontroller, 8-Bit, FLASH, AVR CPU, 24MHz, CMOS, PDIP28; Manufacturer: Microchip; Supplier: Newark; Supplier Part Number: 12AJ7043; Manufacturer Part Number: AVR128DB28-I/SP; RoHS: No; Category: Microcontrollers; Stock: 41; Pricing: 1=5.04, 10=4.9, 30=4.76, 60=4.62, 105=4.41, 510=4.2 (CAD); ComponentLink1URL: http://ww1.microchip.com/downloads/en/DeviceDoc/AVR128DB28-32-48-64-DataSheet-DS40002247A.pdf?src-supplier=Digikey; ComponentLink1Description: http://ww1.microchip.com/downloads/en/DeviceDoc/AVR128DB28-32-48-64-DataSheet-DS40002247A.pdf?src-supplier=Digikey; ComponentLink2URL: https://datasheet.octopart.com/AVR128DB28-I-SP-Microchip-datasheet-168930144.pdf?src-supplier=microchipDIRECT; ComponentLink2Description: https://datasheet.octopart.com/AVR128DB28-I-SP-Microchip-datasheet-168930144.pdf?src-supplier=microchipDIRECT